# EAGLE design MCU (EAGLE 8.6.0)
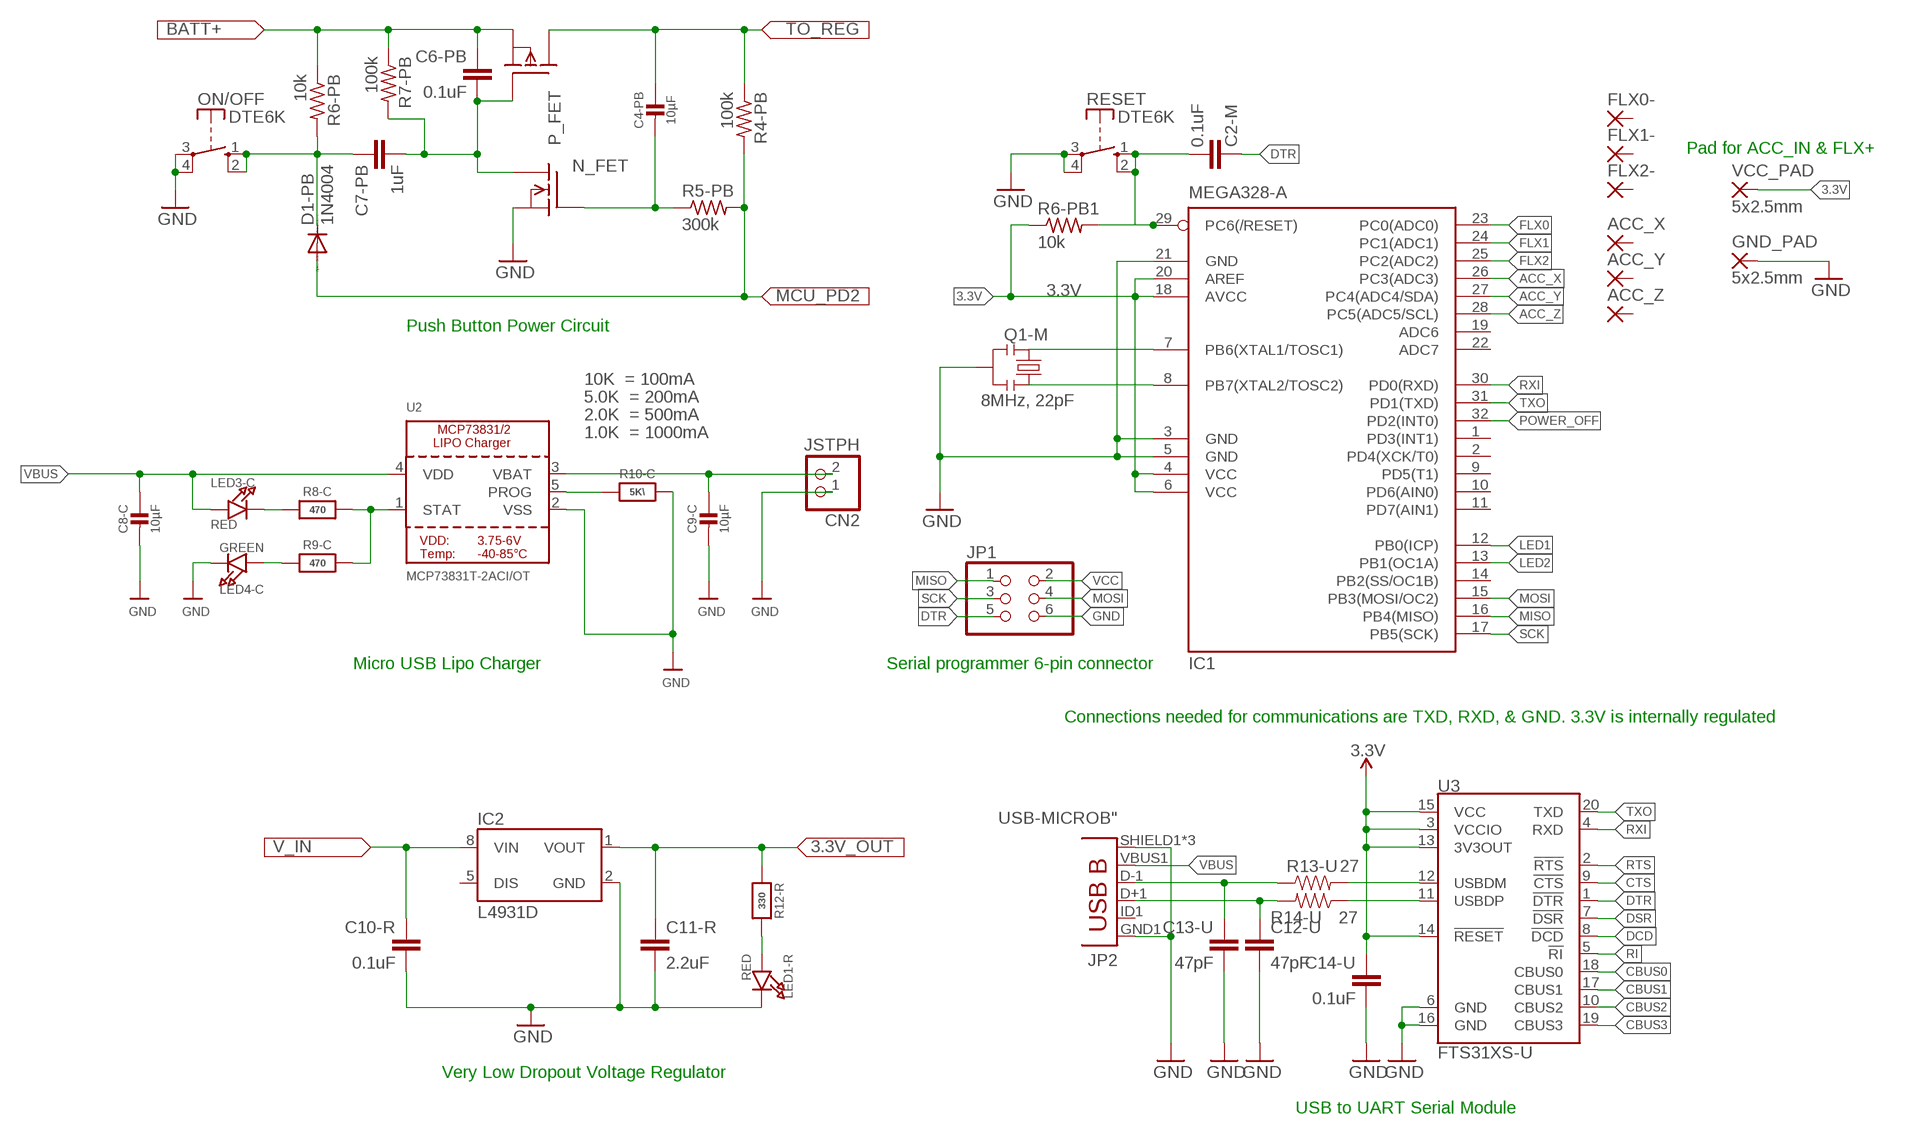
[diagram p0: schematic, sheet 1]

## Parts
ACC_X  1,6/0,8  [1,6/0,8]
ACC_Y  1,6/0,8  [1,6/0,8]
ACC_Z  1,6/0,8  [1,6/0,8]
C2-M  0.1uF  CAP0603-CAP  [0603-CAP]
C4-PB  10µF  CAP_CERAMIC0805-NOOUTLINE  [0805-NO]
C6-PB  0.1uF  0.1UF-25V(+80/-20%)(0603)  [0603-CAP]
C7-PB  1uF  0.1UF-25V(+80/-20%)(0603)  [0603-CAP]
C8-C  10µF  CAP_CERAMIC0805-NOOUTLINE  [0805-NO]
C9-C  10µF  CAP_CERAMIC0805-NOOUTLINE  [0805-NO]
C10-R  0.1uF  0.1UF-25V(+80/-20%)(0603)  [0603-CAP]
C11-R  2.2uF  0.1UF-25V(+80/-20%)(0603)  [0603-CAP]
C12-U  47pF  47PF-50V-5%(0603)  [0603-CAP]
C13-U  47pF  47PF-50V-5%(0603)  [0603-CAP]
C14-U  0.1uF  0.1UF-25V(+80/-20%)(0603)  [0603-CAP]
CN2  JSTPH  JST_2PIN  [JSTPH2]
D1-PB  1N4004  [DO41-10]
FLX0-  1,6/0,8  [1,6/0,8]
FLX1-  1,6/0,8  [1,6/0,8]
FLX2-  1,6/0,8  [1,6/0,8]
GND_PAD  5x2.5mm  WIREPADSMD5-2,5  [5-2,5]
IC1  MEGA328-A  MEGA8-AI  [TQFP32-08]
IC2  L4931D  [SO08]
JP1  PINHD-2X3  [2X03]
JP2  USB-MICROB"  [USB-B-MICRO-SMD_V03]
LED1-R  RED  LED0805_NOOUTLINE  [CHIPLED_0805_NOOUTLINE]
LED3-C  RED  LED0805_NOOUTLINE  [CHIPLED_0805_NOOUTLINE]
LED4-C  GREEN  LED0805_NOOUTLINE  [CHIPLED_0805_NOOUTLINE]
N_FET  BSS101  [TO92]
ON/OFF  DTE6K  [DTE6K]
P_FET  BSS92  [TO92]
Q1-M  8MHz, 22pF  RESONATOR1:1  [RESONATOR-SMD-1:1]
R4-PB  100k  R-US_R0805  [R0805]
R5-PB  300k  R-US_R0805  [R0805]
R6-PB  10k  R-US_R0805  [R0805]
R6-PB1  10k  R-US_R0805  [R0805]
R7-PB  100k  R-US_R0805  [R0805]
R8-C  470  RESISTOR0805_NOOUTLINE  [0805-NO]
R9-C  470  RESISTOR0805_NOOUTLINE  [0805-NO]
R10-C  5K\  RESISTOR0805_NOOUTLINE  [0805-NO]
R12-R  330  RESISTOR0805_NOOUTLINE  [0805-NO]
R13-U  27  27OHM1/10W1%(0603)0603-RES  [0603-RES]
R14-U  27  27OHM1/10W1%(0603)0603-RES  [0603-RES]
RESET  DTE6K  [DTE6K]
U2  MCP73831T-2ACI/OT  MCP73831/2  [SOT23-5]
U3  FTS31XS-U  FT231XS  [SSOP20_L]
VCC_PAD  5x2.5mm  WIREPADSMD5-2,5  [5-2,5]

## Nets
3.3V [power]: C11-R.1 C14-U.1 IC1.4(VCC) IC1.6(VCC) IC1.18(AVCC) IC1.20(AREF) IC2.1(VOUT) R6-PB1.1 R12-R.1 U3.3(VCCIO) U3.13(3V3OUT) U3.14(!RESET) U3.15(VCC) VCC_PAD.1(P)
ACC_X: IC1.26(PC3(ADC3))
ACC_Y: IC1.27(PC4(ADC4/SDA))
ACC_Z: IC1.28(PC5(ADC5/SCL))
CBUS0: U3.18(CBUS0)
CBUS3: U3.19(CBUS3)
CTS: U3.9(!CTS)
DCD: U3.8(!DCD)
DSR: U3.7(!DSR)
DTR: C2-M.2 JP1.5 U3.1(!DTR)
FLX0: IC1.23(PC0(ADC0))
FLX2: IC1.25(PC2(ADC2))
FLX!: IC1.24(PC1(ADC1))
GND: C8-C.2 C9-C.2 C10-R.2 C11-R.2 C12-U.2 C13-U.2 C14-U.2 CN2.1 GND_PAD.1(P) IC1.3(GND) IC1.5(GND) IC1.21(GND) IC2.2(GND) JP1.6 JP2.GND1(GND) JP2.SHIELD1(SHIELD) JP2.SHIELD2(SHIELD) JP2.SHIELD3(SHIELD) LED1-R.C LED4-C.C N_FET.1(S) ON/OFF.3(P) ON/OFF.4(P) Q1-M.2 R10-C.2 RESET.3(P) RESET.4(P) U2.2(VSS) U3.6(GND) U3.16(GND)
MISO: IC1.16(PB4(MISO)) JP1.1
MOSI: IC1.15(PB3(MOSI/OC2)) JP1.4
N$1: R13-U.2 U3.12(USBDM)
N$2: C2-M.1 IC1.29(PC6(/RESET)) R6-PB1.2 RESET.1(S) RESET.2(S)
N$3: IC1.7(PB6(XTAL1/TOSC1)) Q1-M.1
N$4: IC1.8(PB7(XTAL2/TOSC2)) Q1-M.3
N$5: C7-PB.1 D1-PB.C ON/OFF.1(S) ON/OFF.2(S) R6-PB.2
N$7: LED1-R.A R12-R.2
N$9: C4-PB.2 N_FET.2(G) R5-PB.1
N$11: R14-U.1 U3.11(USBDP)
N$12: C12-U.1 JP2.D+1(D+) R14-U.2
N$13: IC1.12(PB0(ICP))
N$14: IC1.13(PB1(OC1A))
N$15: C6-PB.2 C7-PB.2 N_FET.3(D) P_FET.1(G) R7-PB.2
N$16: LED3-C.C R8-C.1
N$17: R8-C.2 R9-C.2 U2.1(STAT)
N$18: R10-C.1 U2.5(PROG)
N$19: LED4-C.A R9-C.1
N$21: C13-U.1 JP2.D-1(D-) R13-U.1
N$22: U3.17(CBUS1)
N$23: U3.10(CBUS2)
POWER_OFF [power]: D1-PB.A IC1.32(PD2(INT0)) R4-PB.2 R5-PB.2
RI: U3.5(!RI)
RTS: U3.2(!RTS)
RXI: IC1.30(PD0(RXD)) U3.4(RXD)
SCK: IC1.17(PB5(SCK)) JP1.3
TXO: IC1.31(PD1(TXD)) U3.20(TXD)
V_IN: C4-PB.1 C10-R.1 IC2.8(VIN) P_FET.2(D) R4-PB.1
VBAT: C6-PB.1 C9-C.1 CN2.2 P_FET.3(S) R6-PB.1 R7-PB.1 U2.3(VBAT)
VBUS: C8-C.1 JP2.VBUS1(VBUS) LED3-C.A U2.4(VDD)
VCC: JP1.2
Unconnected: ACC_X.1(P) ACC_Y.1(P) ACC_Z.1(P) FLX0-.1(P) FLX1-.1(P) FLX2-.1(P) IC1.1(PD3(INT1)) IC1.2(PD4(XCK/T0)) IC1.9(PD5(T1)) IC1.10(PD6(AIN0)) IC1.11(PD7(AIN1)) IC1.14(PB2(SS/OC1B)) IC1.19(ADC6) IC1.22(ADC7) IC2.5(DIS) JP2.ID1(USBID)

## Notes on the sheet
- Pad for ACC_IN & FLX+
- Push Button Power Circuit
- 10K  = 100mA
- 5.0K  = 200mA
- 2.0K  = 500mA
- 1.0K  = 1000mA
- Micro USB Lipo Charger | Serial programmer 6-pin connector
- Connections needed for communications are TXD, RXD, & GND. 3.3V is internally regulated
- Very Low Dropout Voltage Regulator
- USB to UART Serial Module

## Library data of the parts
ACC_X ACC_Y ACC_Z FLX0- FLX1- FLX2- = wirepad:1,6/0,8: THROUGH-HOLE PAD
C2-M = SparkFun:CAP: Capacitor Standard 0603 ceramic capacitor, and 0.1" leaded capacitor.
C4-PB C8-C C9-C = microbuilder:CAP_CERAMIC: Ceramic Capacitors For new designs, use the packages preceded by an '_' character since they are more reliable: The following footprints should be used on most boards: _0402 - Standard footprint for regular board layouts _0603 - Standard footprint for regular board layouts _0805 - Standard footprint for regular board layouts _1206 - Standard footprint for regular board layouts For extremely tight-pitch boards where space is at a premium, the following 'micro-pitch' footprints can be used (smaller pads, no silkscreen outline, etc.): _0402MP - Micro-pitch footprint for very dense/compact boards _0603MP - Micro-pitch footprint for very dense/compact boards _0805MP - Micro-pitch footprint for very dense/compact boards _1206MP - Micro-pitch footprint for very dense/compact boards
C6-PB C10-R C14-U = SparkFun-Capacitors:0.1UF-25V(+80/-20%)(0603): CAP-00810 Ceramic Standard decoupling cap; PROD_ID: CAP-00810
C7-PB C11-R = SparkFun-Capacitors:0.1UF-25V(+80/-20%)(0603): CAP-00810 Ceramic Standard decoupling cap; PROD_ID: CAP-00810; VALUE: 0.1uF
C12-U C13-U = SparkFun-Capacitors:47PF-50V-5%(0603): CAP-08913; PROD_ID: CAP-08913
CN2 = microbuilder:JST_2PIN: JST 2-Pin Right-Angle Connector PH-Series - 4UConnector: 17311 SH-Series - 4UConnector: 07278
D1-PB = diode:1N4004: DIODE general purpose rectifier, 1 A
GND_PAD VCC_PAD = wirepad:WIREPAD: Wire PAD connect wire on PCB
IC1 = atmel:MEGA8: MICROCONTROLLER 8 Kbytes FLASH, 1 kbytes SRAM, 512 bytes EEPROM, USART, 6-channel 10 bit ADC, 2-channel 8 bit ADC Pin compatible with Atmega48, ATMega88, ATMega168 Source: avr.lbr; MPN: ATMEGA8-16AU; OC_FARNELL: 9171371; OC_NEWARK: 73M8863
IC2 = v-reg-3:L4931: STMicroelectronics <http://www.st.com> 250mA low dropout voltage regulator Vin 5V to 28V (transients 40V), disable pin, 50µA shutdown current
JP1 = pinhead:PINHD-2X3: PIN HEADER
JP2 = SparkFun-Connectors:USB-MICROB; PROD_ID: CONN-11752
LED1-R LED3-C LED4-C = microbuilder:LED: LED 0603 - 0603 Surface Mount Package 2mA: Green LED - Low Power (3.9mcd, 2ma, 1.7Vf) - Digikey: 475-2709-2-ND Orange LED - Low Power (9.8mcd, 2ma, 1.8Vf) - Digikey: 475-1194-2-ND Red LED - Low Power (5mcd, 2ma, 1.8Vf) - Digikey: 475-1195-2-ND Yellow LED - Low Power (7mcd, 2ma, 1.8Vf) - Digikey: 475-1196-2-ND 5mA: Blue LED - Low Power (17mcd, 5ma, 2.9Vf) - Digikey: LNJ937W8CRACT-ND 0805 - 0805 Surface Mount Package 2mA: Red LED (8.8mcd, 2mA, 1.8Vf, Clear) - Low Power [Digikey: 475-2510-1-ND] Green LED (5mcd, 2mA, 1.8Vf, Clear) - Low Power [Digikey: 475-2730-1-ND] Yellow LED (11.3mcd, 2mA, 1.8Vf, Clear) - Low Power [Digikey: 475-2555-1-ND] 20mA: Red LED (104mcd, 20mA, Diffused) - LS R976 [Digikey: 475-1278-6-ND] Red LED (12mcd, 20mA, 2.0Vf, Clear) - APT2012EC [Digikey: 754-1128-1-ND] Green LED (15mcd, 20mA, 2.2Vf, Clear) - APT2012GC [Digikey: 754-1131-1-ND] Orange LED (160mcd, 20mA, 2.1Vf, Clear) - APT2012SECK [Digikey: 754-1130-1-ND] 1206 - 1206 Surface Mount Package Green LED (26mcd, 20mA, Diffused) - LG N971 [Digikey: 475-1407-6-ND] Red LED (15mcd, 20mA, Diffused) - LH N974 [Digikey: 475-1416-6-ND] Cree - Cree High-Power Surface Mount LEDs XPEBWT-L1-0000-00D50 - White 111lm 350mA 2.9Vf 6200K 110° XTEAWT-00-0000-00000LEE3 - White 114lm 350mA 2.85Vf 5000K 115° Everlight - Everlight 45-21 Series Surface Mount LEDs 45-21/QK2C-B2832AC2CB2/2T - Warm White 2000mcd 20mA 3.25Vf 3050K 120° 45-21/LK2C-B38452C4CB2/2T - Nuetral White 2000mcd 20mA 3.25Vf 4150K 120° 45-21/LK2C-B50634C6CB2/2T - Cold White 2200mcd 20mA 3.25Vf 5650K 120° PLCC2 Reverse Mount LS T77K-J1L2-1-0-2-R18-Z - Red 11.25mcd 2mA 1.8Vf 630nm 120° LO T77K-L1M2-24-Z - Orange 19.6mcd 2mA 1.8Vf 606nm 120° LY T77K-K2M1-26-Z - Yellow 15.7mcd 2mA 1.8Vf 587nm 120°
N_FET = transistor-fet:BSS101: N-Channel Enhancement MOSFET 200V; 0,16A; 11Ohm
ON/OFF RESET = switch-misc:DT: ITT SWITCH
P_FET = transistor-fet:BSS92: P-Channel Enhancement MOSFET -200V; -0,15A; 11Ohm
Q1-M = Testing:RESONATOR: Resonator Small SMD resonator. This is the itty bitty 10/20MHz resonators with built in caps. CSTCE10M0G55 and CSTCE20M0V53. Footprint for SMD has been used in SFE production for years, and does work okay. 1:1 is an attempt to get larger fillets on the sides so it will be easier to inspect these solders in our AOI machine. The pads have been minimized to match the actual metal under the resonator. To see this relation, it includes an image import of the bottom side of the component. Imported to scale on layer 200.
R4-PB R5-PB R6-PB R6-PB1 R7-PB = rcl:R-US_: RESISTOR, American symbol; SPICEPREFIX: R
R8-C R9-C R10-C R12-R = microbuilder:RESISTOR: Resistors For new designs, use the packages preceded by an '_' character since they are more reliable: The following footprints should be used on most boards: _0402 - Standard footprint for regular board layouts _0603 - Standard footprint for regular board layouts _0805 - Standard footprint for regular board layouts _1206 - Standard footprint for regular board layouts For extremely tight-pitch boards where space is at a premium, the following 'micro-pitch' footprints can be used (smaller pads, no silkscreen outline, etc.): _0402MP - Micro-pitch footprint for very dense/compact boards _0603MP - Micro-pitch footprint for very dense/compact boards _0805MP - Micro-pitch footprint for very dense/compact boards _1206MP - Micro-pitch footprint for very dense/compact boards
R13-U R14-U = SparkFun-Resistors:27OHM1/10W1%(0603): RES-09334; PROD_ID: RES-09334
U2 = microbuilder:MCP73831/2: MCP73831/2 LIPO Charger VDD: 3.75 - 6V Temp -40 - 85°C Programmable Charge Rate: 15-500mA NOTE: STAT is a tri-state logic output on the MCP73831 and an open-drain output on the MCP73832. SOT23-5 with 4.2V output and tri-state logic on STAT = MCP73831T-2ACI/OT
U3 = SparkFun-DigitalIC:FT231X: FTDI FT231X Full Speed USB to Full-handshake UART This USB2.0 Full Speed IC offers a compact bridge to full handshake UART interfaces. The device is a UART, capable of operating up to 3MBaud, with low power consumption (8mA). The FT231X includes the complete FT-X series feature set and enables USB to be added into a system design quickly and easily over a UART interface.; PROD_ID: IC-11524

## Net classes
0 default: width 0.203 mm
1 power: width 0.254 mm

## Board
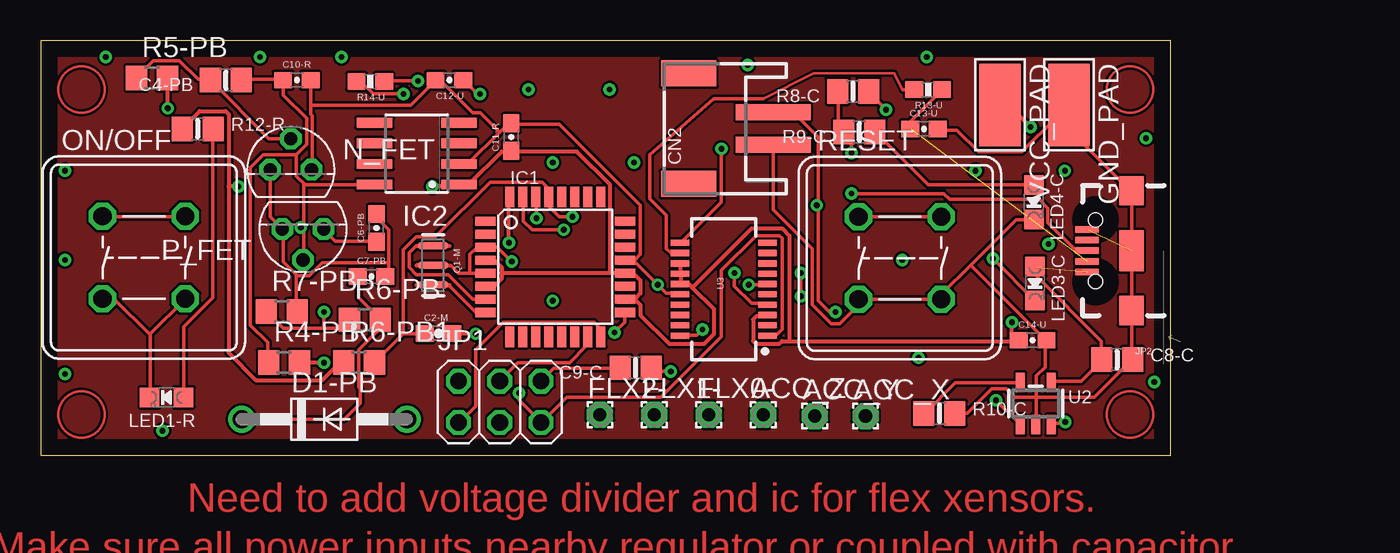
[diagram p1: board, top side]
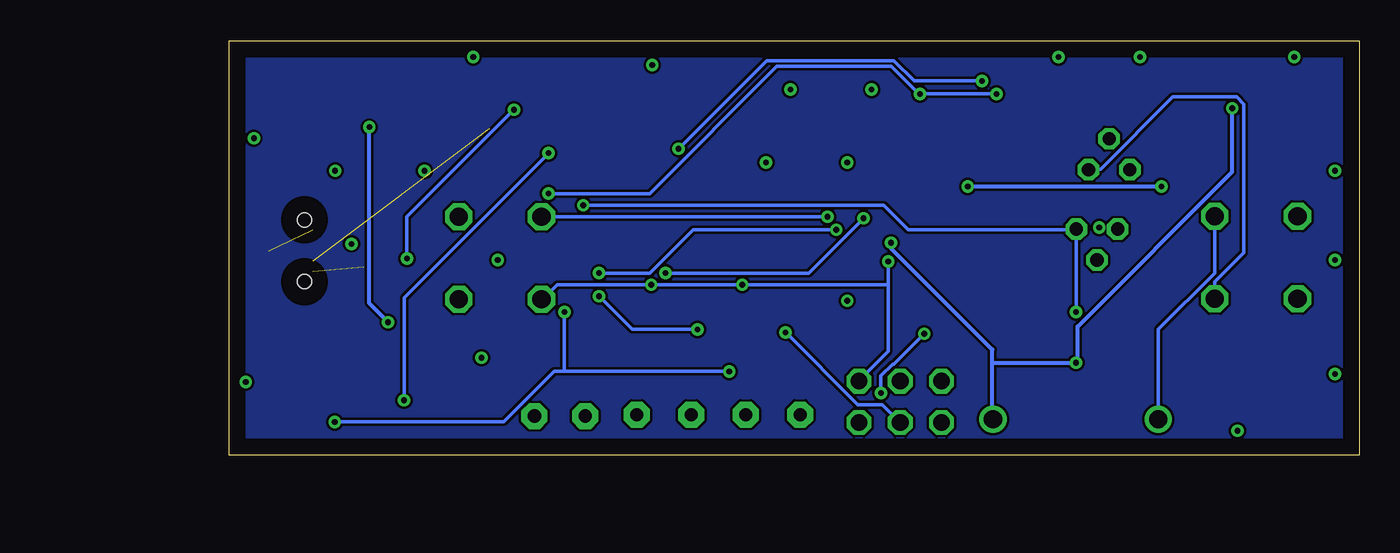
[diagram p2: board, bottom side, seen from below]

Size 69.5 x 25.5 mm. Coordinates in mm from the lower left corner, seen from the top.
Outline: 0,0 69.5,0 69.5,25.5 0,25.5 0,0
Copper layers (1*16): Top 0.035mm / dielectric 1.5mm / Bottom 0.035mm
Design rules "default": minimum track width 6mil, minimum drill 0.35mm, track to track 6mil, track to pad 6mil, pad to pad 6mil, via to via 6mil, smd to smd 6mil, copper to edge 40mil, drill to drill 6mil, minimum pad ring 10mil, minimum via ring 8mil, stop-mask expansion 4mil, vias tented up to drill 0mil, thermal gap 10mil

### Footprints (pad centres in the part's own frame; a part is rotated, then mirrored left to right if it is on the bottom)
1,6/0,8 = drill 0.813 pad 1.6 octagon: 1 0,0
0603-CAP = smd 1.1 x 1: 1 -0.85,0; 2 0.85,0
0805-NO = smd 1.3 x 1.5: 1 -0.95,0; 2 0.95,0
JSTPH2 = smd 1 x 4.6: 1 -1,-3.7; 2 1,-3.7 | smd 1.6 x 3.4: NC1 -3.4,1.5; NC2 3.4,1.5
DO41-10 = drill 1.118: A 5.08,0; C -5.08,0
5-2,5 = smd 2.54 x 5.08: 1 0,0
TQFP32-08 = smd 1.27 x 0.559: 1 -4.293,2.8; 2 -4.293,2; 3 -4.293,1.2; 4 -4.293,0.4; 5 -4.293,-0.4; 6 -4.293,-1.2; 7 -4.293,-2; 8 -4.293,-2.8; 17 4.293,-2.8; 18 4.293,-2; 19 4.293,-1.2; 20 4.293,-0.4; 21 4.293,0.4; 22 4.293,1.2; 23 4.293,2; 24 4.293,2.8 | smd 0.559 x 1.27: 9 -2.8,-4.293; 10 -2,-4.293; 11 -1.2,-4.293; 12 -0.4,-4.293; 13 0.4,-4.293; 14 1.2,-4.293; 15 2,-4.293; 16 2.8,-4.293; 25 2.8,4.293; 26 2,4.293; 27 1.2,4.293; 28 0.4,4.293; 29 -0.4,4.293; 30 -1.2,4.293; 31 -2,4.293; 32 -2.8,4.293
SO08 = smd 0.6 x 2.2: 1 -1.905,-2.6; 2 -0.635,-2.6; 3 0.635,-2.6; 4 1.905,-2.6; 5 1.905,2.6; 6 0.635,2.6; 7 -0.635,2.6; 8 -1.905,2.6
2X03 = drill 1.016 octagon: 1 -2.54,-1.27; 2 -2.54,1.27; 3 0,-1.27; 4 0,1.27; 5 2.54,-1.27; 6 2.54,1.27
USB-B-MICRO-SMD_V03 = smd 1.45 x 0.4: D+1 2.725,0; D-1 2.725,0.65; GND1 2.725,-1.3; ID1 2.725,-0.65; VBUS1 2.725,1.3 | smd 1.5 x 1.8: SHIELD1 0,3.685; SHIELD2 0,-3.685 | smd 1.5 x 2.5: SHIELD3 0,0 | hole 0.85: 2.2,1.9; 2.2,-1.9
CHIPLED_0805_NOOUTLINE = smd 1.2 x 1.2: A 0,-1.05; C 0,1.05
TO92 = drill 0.813 octagon: 1 1.27,0; 2 0,1.905; 3 -1.27,0
DTE6K = drill 1.118 octagon: 1 -2.54,2.54; 2 2.54,2.54; 3 2.54,-2.54; 4 -2.54,-2.54
RESONATOR-SMD-1:1 = smd 0.45 x 1.905: 1 -1.2,0; 2 0,0; 3 1.2,0
R0805 = smd 1.3 x 1.5: 1 -0.95,0; 2 0.95,0
0603-RES = smd 1.1 x 1: 1 -0.85,0; 2 0.85,0
SOT23-5 = smd 0.55 x 1.2: 1 -0.95,-1.3; 2 0,-1.3; 3 0.95,-1.3; 4 0.95,1.3; 5 -0.95,1.3
SSOP20_L = smd 0.381 x 1.143: 1 -2.857,-2.68; 2 -2.223,-2.68; 3 -1.587,-2.68; 4 -0.953,-2.68; 5 -0.318,-2.68; 6 0.318,-2.68; 7 0.953,-2.68; 8 1.587,-2.68; 9 2.223,-2.68; 10 2.857,-2.68; 11 2.857,2.68; 12 2.223,2.68; 13 1.587,2.68; 14 0.953,2.68; 15 0.318,2.68; 16 -0.318,2.68; 17 -0.953,2.68; 18 -1.587,2.68; 19 -2.223,2.68; 20 -2.857,2.68

### Placement (x,y rotation side)
ACC_X  50.74,2.41 0 top
ACC_Y  47.62,2.41 0 top
ACC_Z  44.45,2.49 0 top
C2-M  24.47,7.49 0 top
C4-PB  11.4,23.07 180 top
C6-PB  20.66,13.99 90 top
C7-PB  20.35,10.99 0 top
C8-C  66.22,5.88 0 top
C9-C  36.6,5.38 180 top
C10-R  15.76,23.07 0 top
C11-R  28.95,19.57 90 top
C12-U  25.14,23.07 180 top
C13-U  54.33,20.07 0 top
C14-U  61.02,7.07 0 top
CN2  41.37,20.09 90 top
D1-PB  17.45,2.21 0 top
FLX0-  41.1,2.49 0 top
FLX1-  37.75,2.49 0 top
FLX2-  34.4,2.49 0 top
GND_PAD  63.26,21.55 180 top
IC1  31.66,11.58 0 top
IC2  23.13,18.55 90 top
JP1  28.24,3.28 0 top
JP2  67.09,12.58 180 top
LED1-R  7.75,3.56 90 top
LED3-C  61.17,10.56 180 top
LED4-C  61.09,15.56 180 top
N_FET  15.39,17.56 0 top
ON/OFF  6.35,12.16 0 top
P_FET  16.14,13.91 180 top
Q1-M  24.13,11.68 270 top
R4-PB  14.97,5.71 0 top
R5-PB  6.85,23.21 0 top
R6-PB  19.95,8.33 0 top
R6-PB1  19.59,5.71 0 top
R7-PB  14.83,8.83 0 top
R8-C  49.98,22.38 180 top
R9-C  50.36,19.88 180 top
R10-C  55.28,2.57 0 top
R12-R  9.66,20.07 0 top
R13-U  54.59,22.49 180 top
R14-U  20.28,22.99 180 top
RESET  52.85,12.13 0 top
U2  61.21,3.18 0 top
U3  42.02,10.21 90 top
VCC_PAD  59.02,21.55 180 top

### Tracks (layer width: path | path; a pad name or v marks a point on that pad's centre or on a via)
3.3V  (via drill 0.35)
  Top 0.254: 46.05,7.02 45.61,7.02 45.43,6.84 44.01,6.84 43.83,7.02 43.83,8.36 44.01,8.53 44.63,8.53 U3.3 | 46.05,7.02 60.1,7.02 C14-U.1 59.74,7.11 v59.74,8.18 | v60.9,20.18 59.56,21.51 59.03,21.51 VCC_PAD.1 | 11.56,16.54 11.56,20.98 11.38,21.16 9.78,21.16 8.71,20.09 R12-R.1 | 11.56,16.54 11.56,6.31 13.25,4.62 17.34,4.62 18.4,5.69 18.58,5.69 R6-PB1.1 | 28.36,11.2 28.36,11.56 28,11.91 27.38,11.91 IC1.4 | 28.36,11.2 28.36,10.85 27.91,10.4 27.38,10.4 IC1.6 | U3.13 39.38,11.73 39.38,11.2 U3.14 39.38,11.11 39.38,10.58 U3.15 39.47,10.49 39.92,10.49 40.09,10.31 | 36.54,9.6 36.01,9.6 IC1.18 | 36.54,9.6 36.89,9.96 36.89,10.76 36.54,11.11 36.01,11.11 IC1.20 35.92,11.2 35.03,11.2 | 40.09,10.31 41.43,8.98 41.43,7.47 40.8,6.84 38.67,6.84 36.89,8.62 36.89,9.25 36.54,9.6 | 35.03,11.2 28.36,11.2 | 35.03,11.2 35.03,16.62 32.98,18.67 29.07,18.67 C11-R.1 28.89,18.67 28.36,18.67 26.4,16.71 25.78,16.71 IC2.1 25.69,16.54 v24.09,16.54 | v12.18,16.54 11.56,16.54 | 46.05,7.02 46.05,13.51 45.61,13.96 43.74,13.96 40.09,10.31
  Bottom 0.254: v60.9,20.18 60.9,9.34 v59.74,8.18 | v24.09,16.54 v12.18,16.54
DTR  (via drill 0.35)
  Top 0.203: v26.76,7.47 25.34,7.47 C2-M.2 | v29.43,3.82 29.43,3.38 30.76,2.04 JP1.5 30.85,2.04 32.36,3.56 38.14,3.56 41.87,7.29 41.87,11.38 44.01,13.51 45.43,13.51 45.61,13.34 45.61,7.73 45.25,7.38 44.72,7.38 U3.1
  Bottom 0.203: v26.76,7.47 28.63,5.6 28.71,5.6 29.43,4.89 v29.43,3.82
GND  (via drill 0.35)  (1 unrouted)
  Top 0.203: 6.76,7.47 6.76,3.65 LED1-R.C | 6.76,7.47 8.89,9.6 ON/OFF.3 | ON/OFF.4 3.82,9.6 4.53,9.6 6.67,7.47 6.76,7.47 | 16.62,21.51 16.62,20.98 16.71,20.89 16.71,17.6 N_FET.1 | 16.62,21.51 16.62,23.02 C10-R.2 | U3.16 39.29,9.96 38.49,9.96 v37.96,10.49 36.54,11.91 36.01,11.91 IC1.21 36.54,12 36.89,12.36 36.89,15.38 31.91,20.36 28.98,20.36 C11-R.2 28.89,20.36 28.71,20.36 28.23,19.87 | 28.23,19.87 26.31,17.96 25.78,17.96 IC2.2 | 28.23,19.87 27.03,21.07 26.58,21.07 24.62,23.02 24.36,23.02 C12-U.2 24.27,23.02 22.76,21.51 16.62,21.51 | 62.5,20.8 63.21,21.51 GND_PAD.1 62.5,20.8 | 62.5,20.8 60.36,18.67 57.7,18.67 56.36,20 55.21,20 C13-U.2 | 62.5,20.8 67.03,16.27 JP2.SHIELD2 67.12,16.18 67.12,12.62 JP2.SHIELD3 67.12,12.54 67.12,8.98 JP2.SHIELD1 67.12,8.89 67.12,5.96 C8-C.2 67.12,5.87 64.81,3.56 61.25,3.56 | 61.25,3.56 61.25,1.96 U2.2 | 61.25,3.56 61.25,4.89 61.78,5.42 61.78,7.02 C14-U.2 61.78,7.11 57.21,11.69 | 61.25,3.56 59.92,3.56 59.38,4.09 58.5,4.09 56.98,2.58 56.27,2.58 R10-C.2 | 57.21,11.69 55.47,9.96 55.47,9.6 RESET.3 55.3,9.6 50.41,9.6 RESET.4 50.23,9.51 50.23,9.16 49.16,8.09 48.63,8.09 47.47,9.25 47.47,12.71 45.07,15.11 45.07,19.02 CN2.1 | 57.21,11.69 60.01,14.49 61.07,14.49 LED4-C.C | 26.4,11.2 25.69,11.2 25.25,11.65 Q1-M.2 | 26.4,11.2 27.29,11.2 IC1.5 | 26.4,11.2 26.4,12.36 26.76,12.71 27.29,12.71 IC1.3 27.47,12.8 28.09,12.8 v28.98,11.91 | C9-C.2 35.65,5.33 31.56,5.33 30.85,4.62 JP1.6 | v43.56,10.49 44.63,10.49 U3.6
  Bottom 0.203: ON/OFF.3 8.89,10.67 7.11,12.45 7.11,21.6 7.56,22.05 11.47,22.05 15.91,17.6 16.62,17.6 N_FET.1 | 28.98,10.49 28.98,6.4 30.76,4.62 JP1.6 | 28.98,10.49 v28.98,11.91 | RESET.4 50.23,9.6 49.34,10.49 v43.56,10.49 v37.96,10.49 28.98,10.49
MISO
  Top 0.203: IC1.16 34.4,7.29 34.4,7.82 34.05,8.18 28.45,8.18 26.76,6.49 26.76,3.02 25.78,2.04 JP1.1
MOSI
  Top 0.203: IC1.15 33.6,7.2 33.6,6.76 32.54,5.69 29.34,5.69 28.27,4.62 JP1.4
N$1
  Top 0.152: 53.02,22.49 53.01,22.49 52.5,23.5 47.55,23.5 44.45,21.91
  Top 0.203: 53.02,22.49 53.7,22.49 R13-U.2 | 44.45,21.91 41.41,21.91 37.47,18.47 37.47,15.78 38.49,14.76 38.49,12.71 38.76,12.45 39.29,12.45 U3.12
N$2  (via drill 0.35)
  Top 0.203: RESET.1 RESET.2 | 22.31,7.47 23.56,7.47 C2-M.1 | 22.31,7.47 20.62,5.78 R6-PB1.2 | 22.31,7.47 22.31,12.62 23.11,13.42 24.27,13.42 27.65,16.8 30.85,16.8 31.2,16.45 31.2,15.91 IC1.29 31.29,15.82 31.29,15.29 31.91,14.67 v32.72,14.67
  Bottom 0.203: v32.72,14.67 50.23,14.67 RESET.1
N$3
  Top 0.203: IC1.7 27.29,9.6 26.58,9.6 25.07,11.11 23.11,11.11 22.67,11.56 22.67,12.45 23.02,12.8 23.11,12.88
N$4
  Top 0.203: IC1.8 27.29,8.8 26.76,8.8 25.16,10.4 Q1-M.3
N$5
  Top 0.203: ON/OFF.1 3.82,14.67 8.89,14.67 ON/OFF.2 | C7-PB.1 19.56,10.94 19.56,9.69 20.89,8.36 R6-PB.2 20.89,8.27 20.89,7.82 19.56,6.49 19.56,4.18 19.65,4.09 19.65,3.2 18.67,2.22 12.45,2.22 D1-PB.C
  Bottom 0.203: ON/OFF.2 8.89,11.2 12.36,7.73 12.36,2.22 D1-PB.C
N$6
  pour Top: 0,25 0,0.5 0.5,0 69,0 69.5,0.5 69.5,25 69,25.5 0.5,25.5
N$7
  Top 0.203: LED1-R.A 8.8,3.65 8.8,7.91 10.58,9.69 10.58,20 R12-R.2
N$8
  pour Bottom: 0,25 0,0.5 0.5,0 69,0 69.5,0.5 69.5,25 69,25.5 0.5,25.5
N$9
  Top 0.203: R5-PB.1 5.96,23.29 6.93,24.27 8.53,24.27 9.69,23.11 10.4,23.11 C4-PB.2 10.49,23.02 14.05,19.47 N_FET.2
N$10  (via drill 0.35)
  other vias: 31.5,18
N$11  (via drill 0.35)
  Top 0.203: v23.2,23.02 21.16,23.02 R14-U.1 | v41.87,18.85 41.87,15.56 39.38,13.07 U3.11
  Bottom 0.203: v23.2,23.02 27.38,23.02 28.63,24.27 36.45,24.27 v41.87,18.85
N$12  (via drill 0.35)
  Top 0.203: v22.31,22.23 20.45,22.23 19.74,22.94 19.47,22.94 R14-U.2 | v27.03,22.23 26.85,22.23 26.05,23.02 C12-U.1 | v49.87,16.09 55.56,16.09 55.92,15.73 61.43,15.73 61.96,15.2 61.96,14.31 63.65,12.62 64.36,12.62 JP2.D+1
  Bottom 0.203: v22.31,22.23 v27.03,22.23 27.11,22.23 28.8,23.91 35.83,23.91 43.65,16.09 v49.87,16.09
N$15
  Top 0.203: 21.43,11.82 21.43,11.2 21.25,11.02 C7-PB.2 | 21.43,11.82 21.43,13.87 20.71,14.58 20.71,14.76 C6-PB.2 | 15.73,11.02 15.73,11.11 14.94,11.91 14.94,13.87 P_FET.1 14.85,13.96 14.13,14.67 14.13,17.51 N_FET.3 | 15.73,11.02 15.73,8.89 R7-PB.2 | 21.43,11.82 17.34,11.82 16.54,11.02 15.73,11.02
N$16  (via drill 0.35)
  Top 0.203: v58.59,12.09 LED3-C.C | v52.01,21.25 50.94,22.31 R8-C.1
  Bottom 0.203: v58.59,12.09 58.59,14.67 v52.01,21.25
N$17  (via drill 0.35)
  Top 0.203: v58.76,3.38 60.19,1.96 U2.1 | v49.87,18.58 49.87,19.38 49.43,19.82 R9-C.2 49.34,19.91 49.07,20.18 49.07,22.31 R8-C.2
  Bottom 0.203: v58.76,3.38 58.76,9.69 v49.87,18.58
N$18
  Top 0.203: U2.5 60.19,4.45 56.27,4.45 54.41,2.58 R10-C.1
N$19
  Top 0.203: LED4-C.A 61.07,16.62 54.59,16.62 51.38,19.82 R9-C.1
N$20  (via drill 0.35)
  other vias: 36.5,18
N$21  (1 unrouted)
  Top 0.203: C13-U.1 53.52,20.09 53.52,20.54 55.38,22.4 R13-U.1
N$24  (via drill 0.35)
  other vias: 30,22.5
N$25  (via drill 0.35)
  other vias: 35,22.5
N$26  (via drill 0.35)
  other vias: 43.5,24
N$27  (via drill 0.35)
  other vias: 54.5,24.5
N$28  (via drill 0.35)
  other vias: 68,19.5
N$29  (via drill 0.35)
  other vias: 68.5,4.5
N$30  (via drill 0.35)
  other vias: 16,14
N$31  (via drill 0.35)
  other vias: 7.5,1.5
N$32  (via drill 0.35)
  other vias: 1.5,5
N$33  (via drill 0.35)
  other vias: 1.5,12
N$34  (via drill 0.35)
  other vias: 1.5,17.5
N$35  (via drill 0.35)
  other vias: 4,24.5
N$36  (via drill 0.35)
  other vias: 13.5,24.5
N$37  (via drill 0.35)
  other vias: 18.5,24.5
N$38  (via drill 0.35)
  other vias: 31.5,9.5
N$39  (via drill 0.35)
  other vias: 53,12
N$40  (via drill 0.35)
  other vias: 54,6
N$41  (via drill 0.35)
  other vias: 57.5,17.5
N$42  (via drill 0.35)
  other vias: 62,13
N$43  (via drill 0.35)
  other vias: 63,17.5
POWER_OFF  (via drill 0.35)
  Top 0.254: v28.8,13.07 28.8,15.82 IC1.32 | v17.42,5.69 16,5.69 R4-PB.2 | v7.82,21.34 7.82,23.2 R5-PB.2
  Bottom 0.254: v28.8,13.07 28.8,12.71 22.58,6.49 22.58,5.69 | 22.58,5.69 22.58,2.22 D1-PB.A | 22.58,5.69 v17.42,5.69 17.34,5.78 17.34,7.91 7.82,17.42 v7.82,21.34
RXI  (via drill 0.35)
  Top 0.203: v42.67,11.2 42.67,10.4 43.74,9.34 44.63,9.34 U3.4 | v30.49,14.58 30.49,15.82 IC1.30
  Bottom 0.203: v42.67,11.2 33.87,11.2 v30.49,14.58
SCK  (via drill 0.35)
  Top 0.203: v35.29,7.56 35.92,8.18 35.92,8.71 IC1.17
  Bottom 0.203: v35.29,7.56 30.85,3.11 29.34,3.11 28.27,2.04 JP1.3
TXO  (via drill 0.35)
  Top 0.203: v40.72,7.73 40.36,7.38 39.38,7.38 U3.20 | v46.76,11.2 v46.76,9.78 | v32.18,13.87 30.23,13.87 29.69,14.4 29.69,15.82 IC1.31
  Bottom 0.203: v40.72,7.73 44.72,7.73 v46.76,9.78 | v46.76,11.2 43.65,11.2 40.98,13.87 v32.18,13.87
V_IN
  Top 0.203: C4-PB.1 12.36,23.11 14.85,23.11 C10-R.1 14.94,23.02 14.94,22.14 16.36,20.71 16.36,19.11 15.73,18.49 | 15.73,18.49 13.69,18.49 12.89,17.69 12.89,8 13.96,6.93 13.96,5.78 R4-PB.1 | 16.27,16.62 20.45,16.62 IC2.8 | 16.27,16.62 15.73,17.16 15.73,18.49 | P_FET.2 16.18,12.09 16.18,16.62 16.27,16.62
VBAT  (via drill 0.35)
  Top 0.203: C6-PB.1 20.62,13.16 18.14,13.16 17.42,13.87 P_FET.3 | 17.42,7.82 18.49,7.82 18.94,8.27 R6-PB.1 | 17.42,7.82 14.94,7.82 13.96,8.8 R7-PB.1 | 17.42,7.82 v17.42,8.8 | v63.03,2.04 62.94,1.96 62.23,1.96 U2.3 | v38.76,5.16 37.78,5.16 37.6,5.33 C9-C.1 | 47.83,15.38 47.83,9.51 48.54,8.8 v48.9,8.8 | 47.83,15.38 47.83,19.56 46.32,21.07 45.07,21.07 CN2.2 | v47.74,15.38 47.83,15.38
  Bottom 0.203: v17.42,8.8 17.42,13.87 P_FET.3 17.51,13.87 27.74,13.87 29.25,15.38 v47.74,15.38 | v63.03,2.04 52.63,2.04 49.52,5.16 48.9,5.16 | v38.76,5.16 48.9,5.16 | 48.9,5.16 v48.9,8.8
VBUS  (1 unrouted)
  Top 0.203: LED3-C.A 61.25,11.56 61.25,11.02 65.25,7.02 65.25,5.96 C8-C.1 65.25,5.78 64.01,4.53 62.23,4.53 U2.4
(copper drawn outside any net)
  shapes: Top circle x4

### Text on the board
Top: Need to add voltage divider and ic for flex xensors. | Make sure all power inputs nearby regulator or coupled with capacitor.